# Altium schematic sheet Counter_Display_v2.SchDoc
size A3; SPICEModelCacheEMTSWJOG: <root> / <DocumentId>EMTSWJOG</DocumentId> / <CacheFrame Number="0"> / <Model Name="cap" Kind="MDL"> / <Text>*Default semiconductor capacitor / .MODEL CAP C()</Text> / </Model> / </CacheFrame> / </root>; ENG_APP_DATE: --/--/--; DSN_APP_DATE: --/--/--; CHK_APP_DATE: --/--/--; Organization: Infineon AG; Address3: Germany; DocumentNumber: 1; SheetNumber: 1; SheetTotal: 1
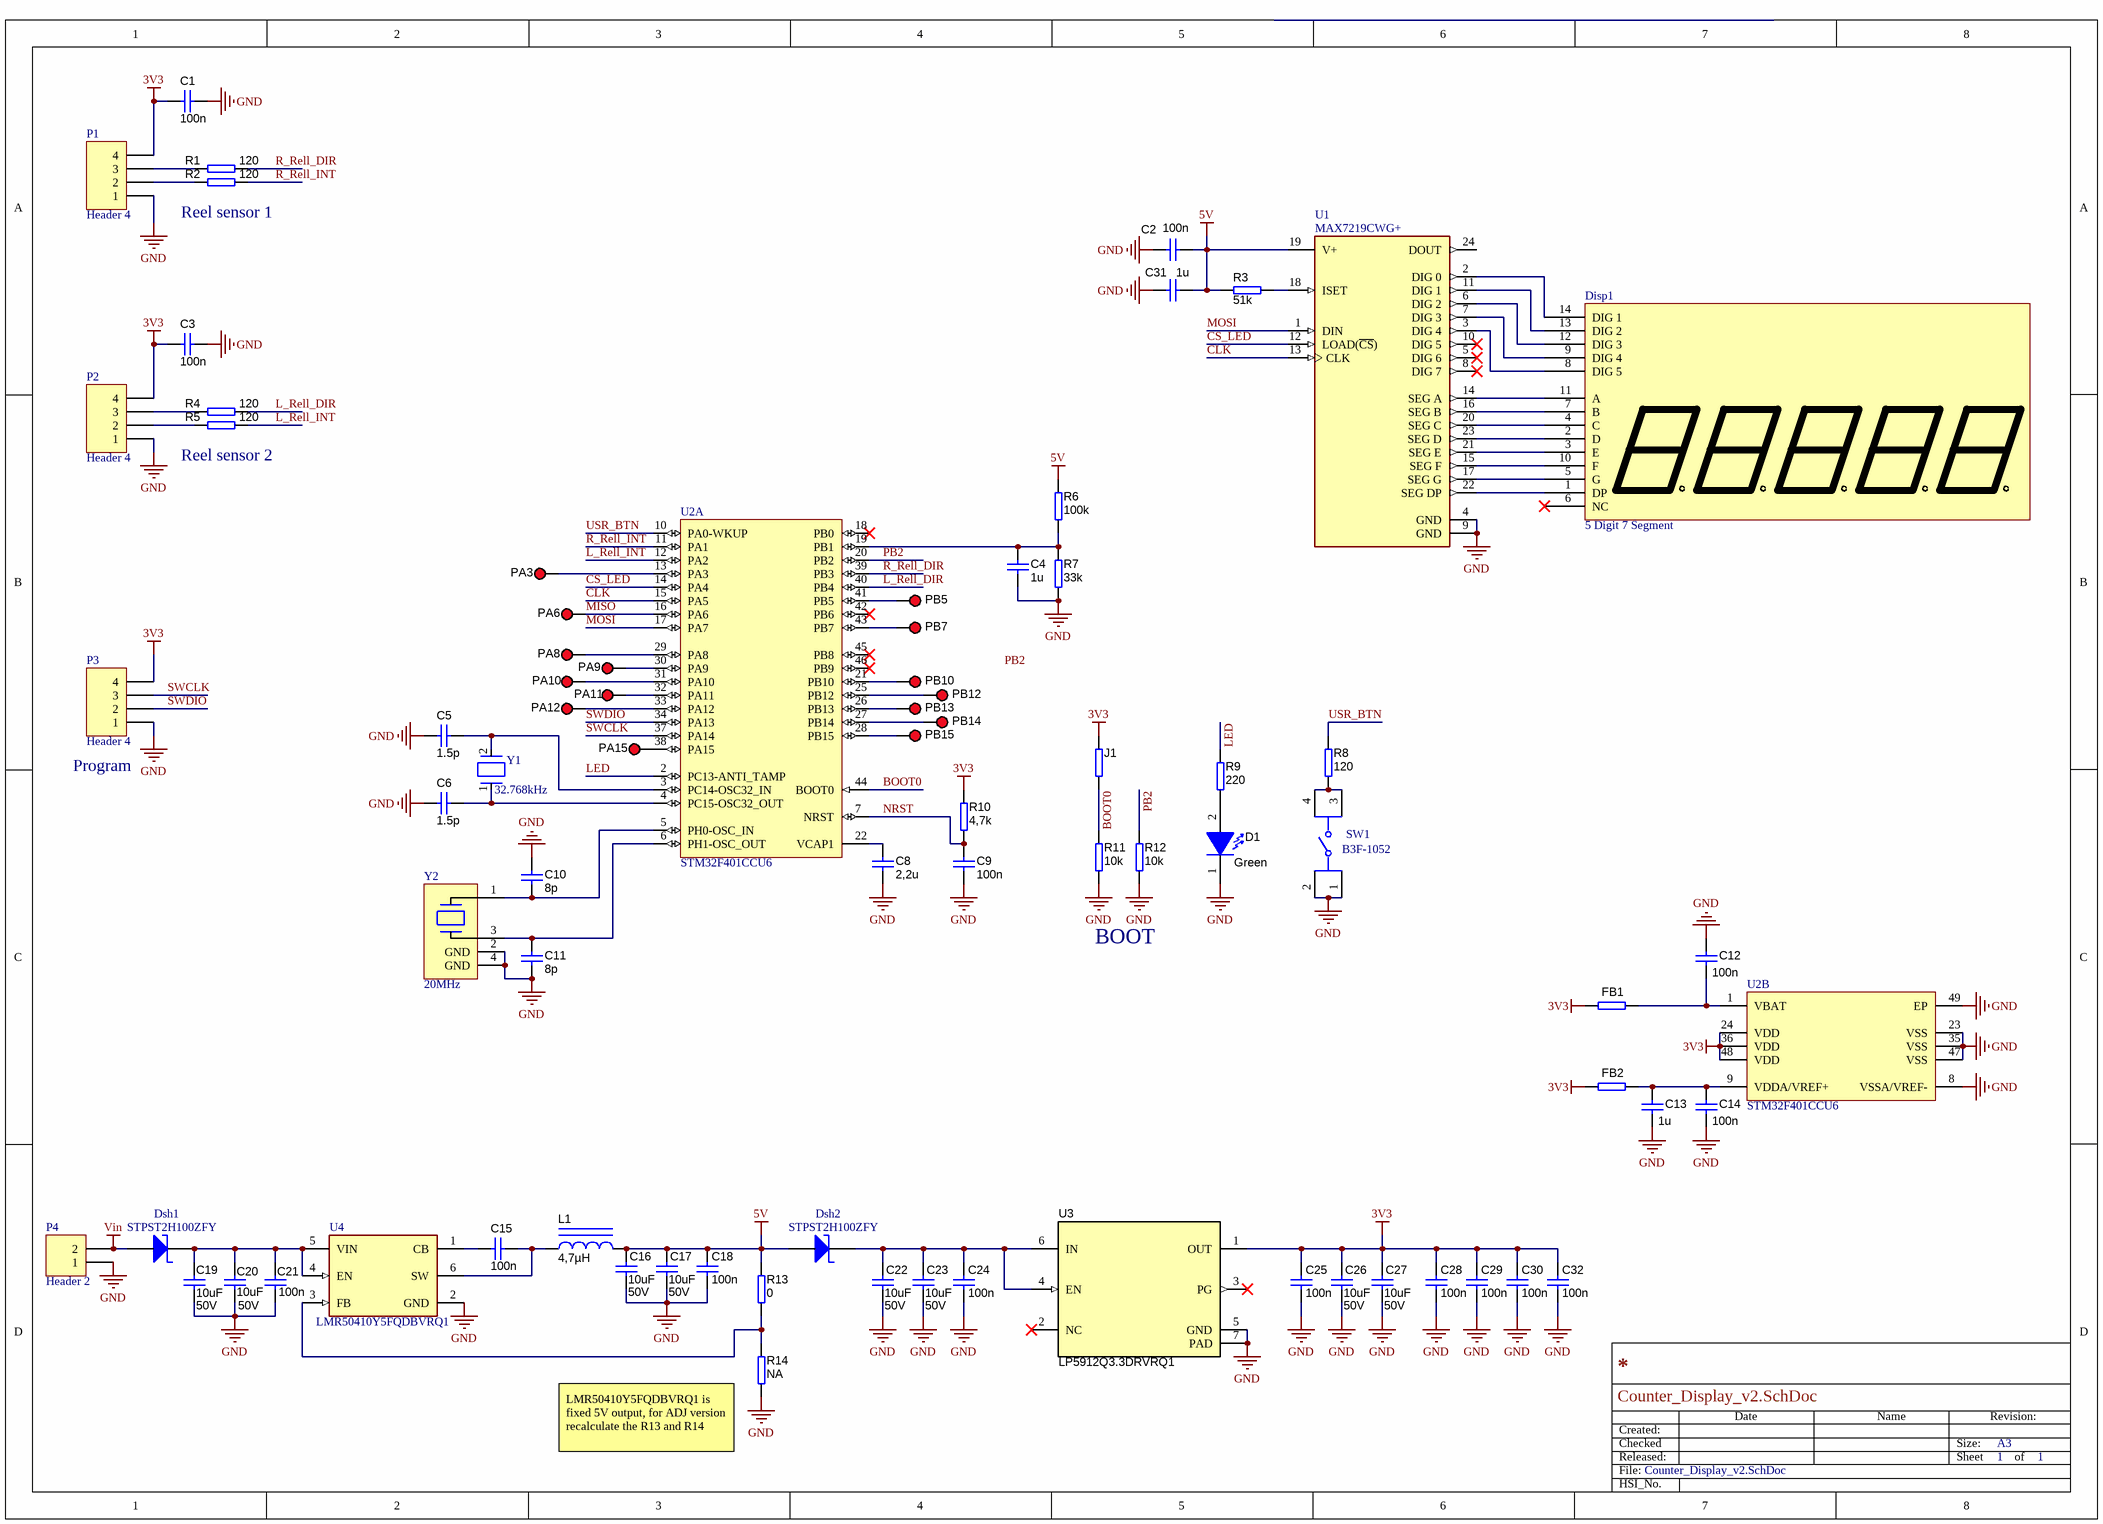
[diagram p0: Counter_Display_v2.SchDoc]

## Parts
C1  value 100n  [0805_HV]
C2  value 100n  [0805_HV]
C3  value 100n  [0805_HV]
C4  value 1u  [0805_HV]
C5  value 1.5p  [0805_HV]
C6  value 1.5p  [0805_HV]
C8  value 2,2u  [0805_HV]
C9  value 100n  [0805_HV]
C10  value 8p  [0805_HV]
C11  value 8p  [0805_HV]
C12  value 100n  [0805_HV]
C13  value 1u  [0805_HV]
C14  value 100n  [0805_HV]
C15  value 100n  [0805_HV]
C16  value 10uF  Value1: 50V  [1206_180]
C17  value 10uF  Value1: 50V  [1206_180]
C18  value 100n  [0805_HV]
C19  value 10uF  Value1: 50V  [1206_180]
C20  value 10uF  Value1: 50V  [1206_180]
C21  value 100n  [0805_HV]
C22  value 10uF  Value1: 50V  [1206_180]
C23  value 10uF  Value1: 50V  [1206_180]
C24  value 100n  [0805_HV]
C25  value 100n  [0805_HV]
C26  value 10uF  Value1: 50V  [1206_180]
C27  value 10uF  Value1: 50V  [1206_180]
C28  value 100n  [0805_HV]
C29  value 100n  [0805_HV]
C30  value 100n  [0805_HV]
C31  value 1u  [0805_HV]
C32  value 100n  [0805_HV]
D1  value Green  [WL-SMCW_GREEN]  (hidden comment: 150060GS75000)
Disp1  5 Digit 7 Segment  [5 Digit 7 Seg LED]
Dsh1  value STPST2H100ZFY  [ONSC-SOD-123-2-425-04_V]  (hidden comment: DIODE_Shottky)
Dsh2  value STPST2H100ZFY  [ONSC-SOD-123-2-425-04_V]  (hidden comment: DIODE_Shottky)
FB1  (no value)  [0805_HV]
FB2  (no value)  [0805_HV]
J1  (no value)  [0805_HV]
L1  ValueDisplayed: 4,7µH  [MSS5121]  (hidden comment: MSS5121-333MLB)
P1  Header 4  [4-Pol. Connector]
P2  Header 4  [4-Pol. Connector]
P3  Header 4  [HDR1X4]
P4  Header 2  [HDR1X2]
PA3  (no value)  [TP]
PA6  (no value)  [TP]
PA8  (no value)  [TP]
PA9  (no value)  [TP]
PA10  (no value)  [TP]
PA11  (no value)  [TP]
PA12  (no value)  [TP]
PA15  (no value)  [TP]
PB5  (no value)  [TP]
PB7  (no value)  [TP]
PB10  (no value)  [TP]
PB12  (no value)  [TP]
PB13  (no value)  [TP]
PB14  (no value)  [TP]
PB15  (no value)  [TP]
R1  value 120  [0805_HV]
R2  value 120  [0805_HV]
R3  value 51k  [0805_HV]
R4  value 120  [0805_HV]
R5  value 120  [0805_HV]
R6  value 100k  [0805_HV]
R7  value 33k  [0805_HV]
R8  value 120  [0805_HV]
R9  value 220  [0805_HV]
R10  value 4,7k  [0805_HV]
R11  value 10k  [0805_HV]
R12  value 10k  [0805_HV]
R13  value 0  [0805_HV]
R14  value NA  [0805_HV]
SW1  B3F-1052  [Omron_B3F-1052_0]
U1  MAX7219CWG+  [Maxim_Integrated_W24-1_IPC_A]
U2  STM32F401CCU6  [STM-UFQFPN48_M]  (parts A,B of 2)
U3  LP5912Q3.3DRVRQ1  [DRV0006A]
U4  LMR50410Y5FQDBVRQ1  [Texas_Instruments_DBV0006A_IPC_A]
Y1  Part Number: 32.768kHz  [Quartz_32.768kHz]  (hidden comment: Qartz_32,768kHz)
Y2  Part Number: 20MHz  [Crystal Oscilator 25MHz]  (hidden comment: Qartz_20MHz)

## Nets
3V3: C1.1 C3.1 C25.1 C26.1 C27.1 C28.1 C29.1 C30.1 C32.1 FB1.2 FB2.2 J1.2 P1.4 P2.4 P3.4 R10.2 U2.24(VDD) U2.36(VDD) U2.48(VDD) U3.1(OUT)
5V: C2.2 C16.1 C17.1 C18.1 C31.2 Dsh2.A L1.2 R3.1 R6.1 R13.1 U1.19(V+)
GND: C1.2 C2.1 C3.2 C4.2 C5.1 C6.1 C8.2 C9.1 C10.1 C11.2 C12.1 C13.2 C14.2 C16.2 C17.2 C18.2 C19.2 C20.2 C21.2 C22.2 C23.2 C24.2 C25.2 C26.2 C27.2 C28.2 C29.2 C30.2 C31.1 C32.2 D1.1(K) P1.1 P2.1 P3.1 P4.1 R7.2 R11.1 R12.1 R14.2 SW1.1 SW1.2 U1.4(GND) U1.9(GND) U2.8(VSSA/VREF-) U2.23(VSS) U2.35(VSS) U2.47(VSS) U2.49(EP) U3.5(GND) U3.7(PAD) U4.2(GND) Y2.2(GND) Y2.4(GND)
Vin: Dsh1.A P4.2
BOOT0: J1.1 R11.2 U2.44(BOOT0)
CLK: U1.13(CLK) U2.15(PA5)
CS_LED: U1.12(LOAD(~{CS})) U2.14(PA4)
L_Rell_DIR: R4.2 U2.40(PB4)
L_Rell_INT: R5.2 U2.12(PA2)
LED: R9.2 U2.2(PC13-ANTI_TAMP)
MISO: PA6.1 U2.16(PA6)
MOSI: U1.1(DIN) U2.17(PA7)
NRST: C9.2 R10.1 U2.7(NRST)
PB2: R12.2 U2.20(PB2)
R_Rell_DIR: R1.2 U2.39(PB3)
R_Rell_INT: R2.2 U2.11(PA1)
SWCLK: P3.3 U2.37(PA14)
SWDIO: P3.2 U2.34(PA13)
USR_BTN: R8.2 U2.10(PA0-WKUP)
NetC4_1: C4.1 R6.2 R7.1 U2.19(PB1)
NetC5_2: C5.2 U2.3(PC14-OSC32_IN) Y1.2
NetC6_2: C6.2 U2.4(PC15-OSC32_OUT) Y1.1
NetC8_1: C8.1 U2.22(VCAP1)
NetC10_2: C10.2 U2.5(PH0-OSC_IN) Y2.1
NetC11_1: C11.1 U2.6(PH1-OSC_OUT) Y2.3
NetC12_2: C12.2 FB1.1 U2.1(VBAT)
NetC13_1: C13.1 C14.1 FB2.1 U2.9(VDDA/VREF+)
NetC15_1: C15.1 U4.1(CB)
NetC15_2: C15.2 L1.1 U4.6(SW)
NetC19_1: C19.1 C20.1 C21.1 Dsh1.K U4.4(EN) U4.5(VIN)
NetC22_1: C22.1 C23.1 C24.1 Dsh2.K U3.4(EN) U3.6(IN)
NetD1_2: D1.2(A) R9.1
NetDisp1_1: Disp1.1(DP) U1.22(SEG_DP)
NetDisp1_2: Disp1.2(D) U1.23(SEG_D)
NetDisp1_3: Disp1.3(E) U1.21(SEG_E)
NetDisp1_4: Disp1.4(C) U1.20(SEG_C)
NetDisp1_5: Disp1.5(G) U1.17(SEG_G)
NetDisp1_7: Disp1.7(B) U1.16(SEG_B)
NetDisp1_8: Disp1.8(DIG_5) U1.3(DIG_4)
NetDisp1_9: Disp1.9(DIG_4) U1.7(DIG_3)
NetDisp1_10: Disp1.10(F) U1.15(SEG_F)
NetDisp1_11: Disp1.11(A) U1.14(SEG_A)
NetDisp1_12: Disp1.12(DIG_3) U1.6(DIG_2)
NetDisp1_13: Disp1.13(DIG_2) U1.11(DIG_1)
NetDisp1_14: Disp1.14(DIG_1) U1.2(DIG_0)
NetP1_2: P1.2 R2.1
NetP1_3: P1.3 R1.1
NetP2_2: P2.2 R5.1
NetP2_3: P2.3 R4.1
NetPA3_1: PA3.1 U2.13(PA3)
NetPA8_1: PA8.1 U2.29(PA8)
NetPA9_1: PA9.1 U2.30(PA9)
NetPA10_1: PA10.1 U2.31(PA10)
NetPA11_1: PA11.1 U2.32(PA11)
NetPA12_1: PA12.1 U2.33(PA12)
NetPA15_1: PA15.1 U2.38(PA15)
NetPB5_1: PB5.1 U2.41(PB5)
NetPB7_1: PB7.1 U2.43(PB7)
NetPB10_1: PB10.1 U2.21(PB10)
NetPB12_1: PB12.1 U2.25(PB12)
NetPB13_1: PB13.1 U2.26(PB13)
NetPB14_1: PB14.1 U2.27(PB14)
NetPB15_1: PB15.1 U2.28(PB15)
NetR3_2: R3.2 U1.18(ISET)
NetR8_1: R8.1 SW1.3 SW1.4
NetR13_2: R13.2 R14.1 U4.3(FB)

Not connected (* = marked no-connect by the designer): Disp1 6(NC)*; U1 5(DIG_6)* 8(DIG_7)* 10(DIG_5)* 24(DOUT); U2 18(PB0)* 42(PB6)* 45(PB8)* 46(PB9)*; U3 2(NC)* 3(PG)*

## Notes on the sheet
- Reel sensor 1
- Reel sensor 2
- (near P3) Program
- BOOT
- (near R14) LMR50410Y5FQDBVRQ1 is fixed 5V output, for ADJ version recalculate the R13 and R14
- Labels drawn without touching a wire or pin: PB2
- File:
- Created:
- Checked
- Released:
- Date
- Name
- Size:
- Sheet
- Revision:
- A3
- of
- HSI_No.

## Library data of the parts
C1-C6 C8-C15 C18 C21 C24 C25 C28-C32 = C0805: CAP, CERM, +/- 10%, X7S,  0805; CompType: Capacitor; Tolerance_%: 10; SizeArea_mm2: 2.5; SizeAreaWB_mm2: 6.75; SizeX_mm: 2; SizeY_mm: 1.25; SizeZ_mm: 1.45; Value1: 25V; PackageReference: 0805; MountType: SMT; Technology: Ceramic; TempCo: X7S
C16 C17 C19 C20 C22 C23 C26 C27 = C1206: CAP, CERM, NP0, 1206; Tolerance_%: 10; TempCo: X7R; TaMin_C: -55; TaMax_C: 125; SizeArea_mm2: 5.12; SizeAreaWB_mm2: 10.92; SizeX_mm: 3.2; SizeY_mm: 1.6; SizeZ_mm: 1.8; PackageReference: 1206; MountType: SMT; Technology: Ceramic
D1 = 150060GS75000: LED, Green, SMD; Manufacturer: Wurth Elektronik; Type: InGaN; Vf_V: 3.2; Value2: 3.2V; Io_A: 0.02; Tjmax_C: 85; Value1: W; Angle: 140; U/M: EA; CompType: LED; PartNumber: 150060GS75000; SymbolVersion: 2008-11-06; MountType: SMT; RoHS: Y; PackageReference: LED_0603; Color: Green; Published: 2008-07-11; Publisher: Texas Instruments; ComponentLink1URL: http://katalog.we-online.de/led/datasheet/150060GS75000.pdf; ComponentLink1Description: Datasheet link; LatestRevisionDate: 2015-10-23; Supplier 1: Digi-Key; Supplier Part Number 1: 732-4971-1-ND; Supplier 2: Mouser; Supplier Part Number 2: 710-150060GS75000; Supplier 3: Farnell; Supplier Part Number 3: 2322070
Disp1 = 5 Digit 7 Segment: 0,2" 7 Segment LED 5 Digit Display
Dsh1 Dsh2 = DIODE_Shottky: Diode Shottky
FB1 FB2 J1 R1-R14 = R0805: RES, 1%, 0.1 W, 0805; SizeX_mm: 2; SizeY_mm: 1.25; SizeZ_mm: 0.75; PackageReference: 0805; Value1: 1%; MountType: SMT
L1 = MSS5121-333MLB: Inductor, Shielded Drum Core, Ferrite, 33 µH, 0.67 A, 0.48 ohm, SMD; Manufacturer: Coilcraft; Value: 33uH; Ind_H: 33.0E-6; Imax_A: 0.67; Irms: 0.76A @ 40C rise; Isat: 0.67A @ 30% inductance drop; DCR_ohm: 0.48; Value2: 0.67A; AEC Category: Q200; SymbolVersion: 2008-07-23; CompType: Inductor; PartNumber: MSS5121-333MLB; Value1: 0.48 ohm; Technology: Shielded Drum Core; MountType: SMT; Material: Ferrite; PackageReference: MSS5121; Published: 2008-06-26; Publisher: Texas Instruments; LatestRevisionDate: 2016-06-24; ComponentLink1Description: Datasheet link; ComponentLink1URL: http://www.coilcraft.com/pdfs/mss5121.pdf; RoHS: Y; AEC Qualified: ?
P1-P3 = Header 4: Header, 4-Pin; LatestRevisionDate: 17-Jul-2002; LatestRevisionNote: Re-released for DXP Platform.; Publisher: Altium Limited
P4 = Header 2: Header, 2-Pin; LatestRevisionDate: 17-Jul-2002; LatestRevisionNote: Re-released for DXP Platform.; Publisher: Altium Limited
PA3 PA6 PA8-PA12 PA15 PB5 PB7 PB10 PB12-PB15 = TP: Test Point, Miniature, Red, TH; PartNumber: 5000; Manufacturer: Keystone; CNHeader: FALSE; ContactFinish: Silver; CT: TRUE; Green_Lifecycle: Active; Green_REACh: Passed; PackageReference: Red Miniature Testpoint; CompType: Test Point; RoHS: Y; MountType: TH; ComponentLink1Description: Datasheet URL; ComponentLink1URL: http://www.keyelco.com/userAssets/file/M60-2p60.pdf; Publisher: Texas Instruments; LatestRevisionDate: 26/05/2017; Supplier 1: Digi-Key; Supplier Part Number 1: 36-5000-ND; Supplier 2: Mouser; Supplier Part Number 2: 534-5000; Color: Red; Green_EU RoHS-2: Incomplete; Green_EU RoHS: Passed
U2 = STM32F401CCU6: ARM Cortex-M4 32-bit MCU+FPU, 105 DMIPS, 256 kB Flash, 64 kB Internal RAM, 36 I/Os, 48-pin UFQFPN, -40 to 85 degC, Tray; Manufacturer: STMicroelectronics; Operating Frequency(F) (Processor speed) (MHz): 84; Supply Voltage(Vcc) min (V): 1.8; FLASH Size (Prog) (kB): 256; Supply Voltage(Vcc) max (V): 3.6; I/Os (High Current): 36; Internal RAM Size (kB): 64; PackageVersion: Rev. 1, 04/2013; Core: ARM Cortex-M4; ComponentLink2Description: Datasheet; ComponentLink1Description: Manufacturer URL; PackageDescription: 48-Pin Ultra Thin Fine Pitch Quad Flat No-Lead, 7 x 7 x 0.6 mm Body, 0.5 mm Pitch, Exposed Pad; ComponentLink3Description: Package Specification; DatasheetVersion: Rev. 1; ComponentLink1URL: http://www.st.com/web/en/home.html; Mounting Technology: Surface Mount; Packing: Tray; ComponentLink3URL: http://www.st.com/st-web-ui/static/active/en/resource/technical/document/data_brief/DM00071938.pdf; PartNumber: STM32F401CCU6; PackageReference: UFQFPN48; ComponentLink2URL: http://www.st.com/st-web-ui/static/active/en/resource/technical/document/data_brief/DM00071938.pdf
U3 = LP5912Q3.3DRVRQ1: Ultra Low-Noise, 500-mA Linear Regulator for RF and Analog Circuits - Requires No Bypass Capacitor, DRV0006A; Alternate PartNumber: LP5912Q3.3DRVTQ1; Manufacturer: Texas Instruments; SymbolCreator: a0411947; SizeArea_mm2: 4; SizeAreaWB_mm2: 9; SizeX_mm: 2; SizeZ_mm: 0.8; CompType: IC; U/M: EA; SymbolVersion: 2016-05-21; PartNumber: LP5912Q3.3DRVRQ1; PackageReference: DRV0006A; PackageDescription: WSON-6; MountType: SMT; SizeY_mm: 2; ComponentLink1Description: Datasheet Link; ComponentLink1URL: http://www.ti.com/lit/ds/symlink/lp5912-q1.pdf; RoHS: Y; Publisher: Texas Instruments; LatestRevisionDate: 2016-07-23; Alternate Manufacturer: Texas Instruments
Y1 = Qartz_32,768kHz: CRYS; Manufacturer: Euroquartz; Category 008Acd80318Bdb4D: Crystals/Resonators/Oscillators; frequency: 16 MHz; Category 7542B8484461Ae85: Passive Components; Category 9Afb57F1Abf5413C: Crystals; load_capacitance: 18 pF; Num Pins: 2; helpURL: https://upverter.com/upn/revision/05c5f50b0b55a54c/; ComponentLink2Description: Datasheet; Temperature: -40°C to +85°C; Package: SMT_XTAL_11MM35_3MM68; Supplier 2: Mouser; Supplier 1: Digi-Key; ComponentLink1URL: https://upverter.com/upn/revision/05c5f50b0b55a54c/; ComponentLink1Description: Upverter; ComponentLink2URL: https://upverter.com/datasheet/0b0a610900101a63fb5a28c721a8a2dd099ef9d5.pdf; RoHS: TRUE; Temperature Range High: +85°C; Digikey Description: CRYS; Lead Free: yes; Temperature Range Low: -40°C; Octopart Part Number: 45978c55d5b29a50
Y2 = Qartz_20MHz: CRYS; Manufacturer: Euroquartz; Category 008Acd80318Bdb4D: Crystals/Resonators/Oscillators; frequency: 16 MHz; Category 7542B8484461Ae85: Passive Components; Category 9Afb57F1Abf5413C: Crystals; load_capacitance: 18 pF; Num Pins: 2; helpURL: https://upverter.com/upn/revision/05c5f50b0b55a54c/; ComponentLink2Description: Datasheet; Temperature: -40°C to +85°C; Package: SMT_XTAL_11MM35_3MM68; Supplier 2: Mouser; Supplier 1: Digi-Key; ComponentLink1URL: https://upverter.com/upn/revision/05c5f50b0b55a54c/; ComponentLink1Description: Upverter; ComponentLink2URL: https://upverter.com/datasheet/0b0a610900101a63fb5a28c721a8a2dd099ef9d5.pdf; RoHS: TRUE; Temperature Range High: +85°C; Digikey Description: CRYS; Lead Free: yes; Temperature Range Low: -40°C; Octopart Part Number: 45978c55d5b29a50